# EAGLE design Wireless Module ESP32-H2 V1.0 (EAGLE 9.6.2)
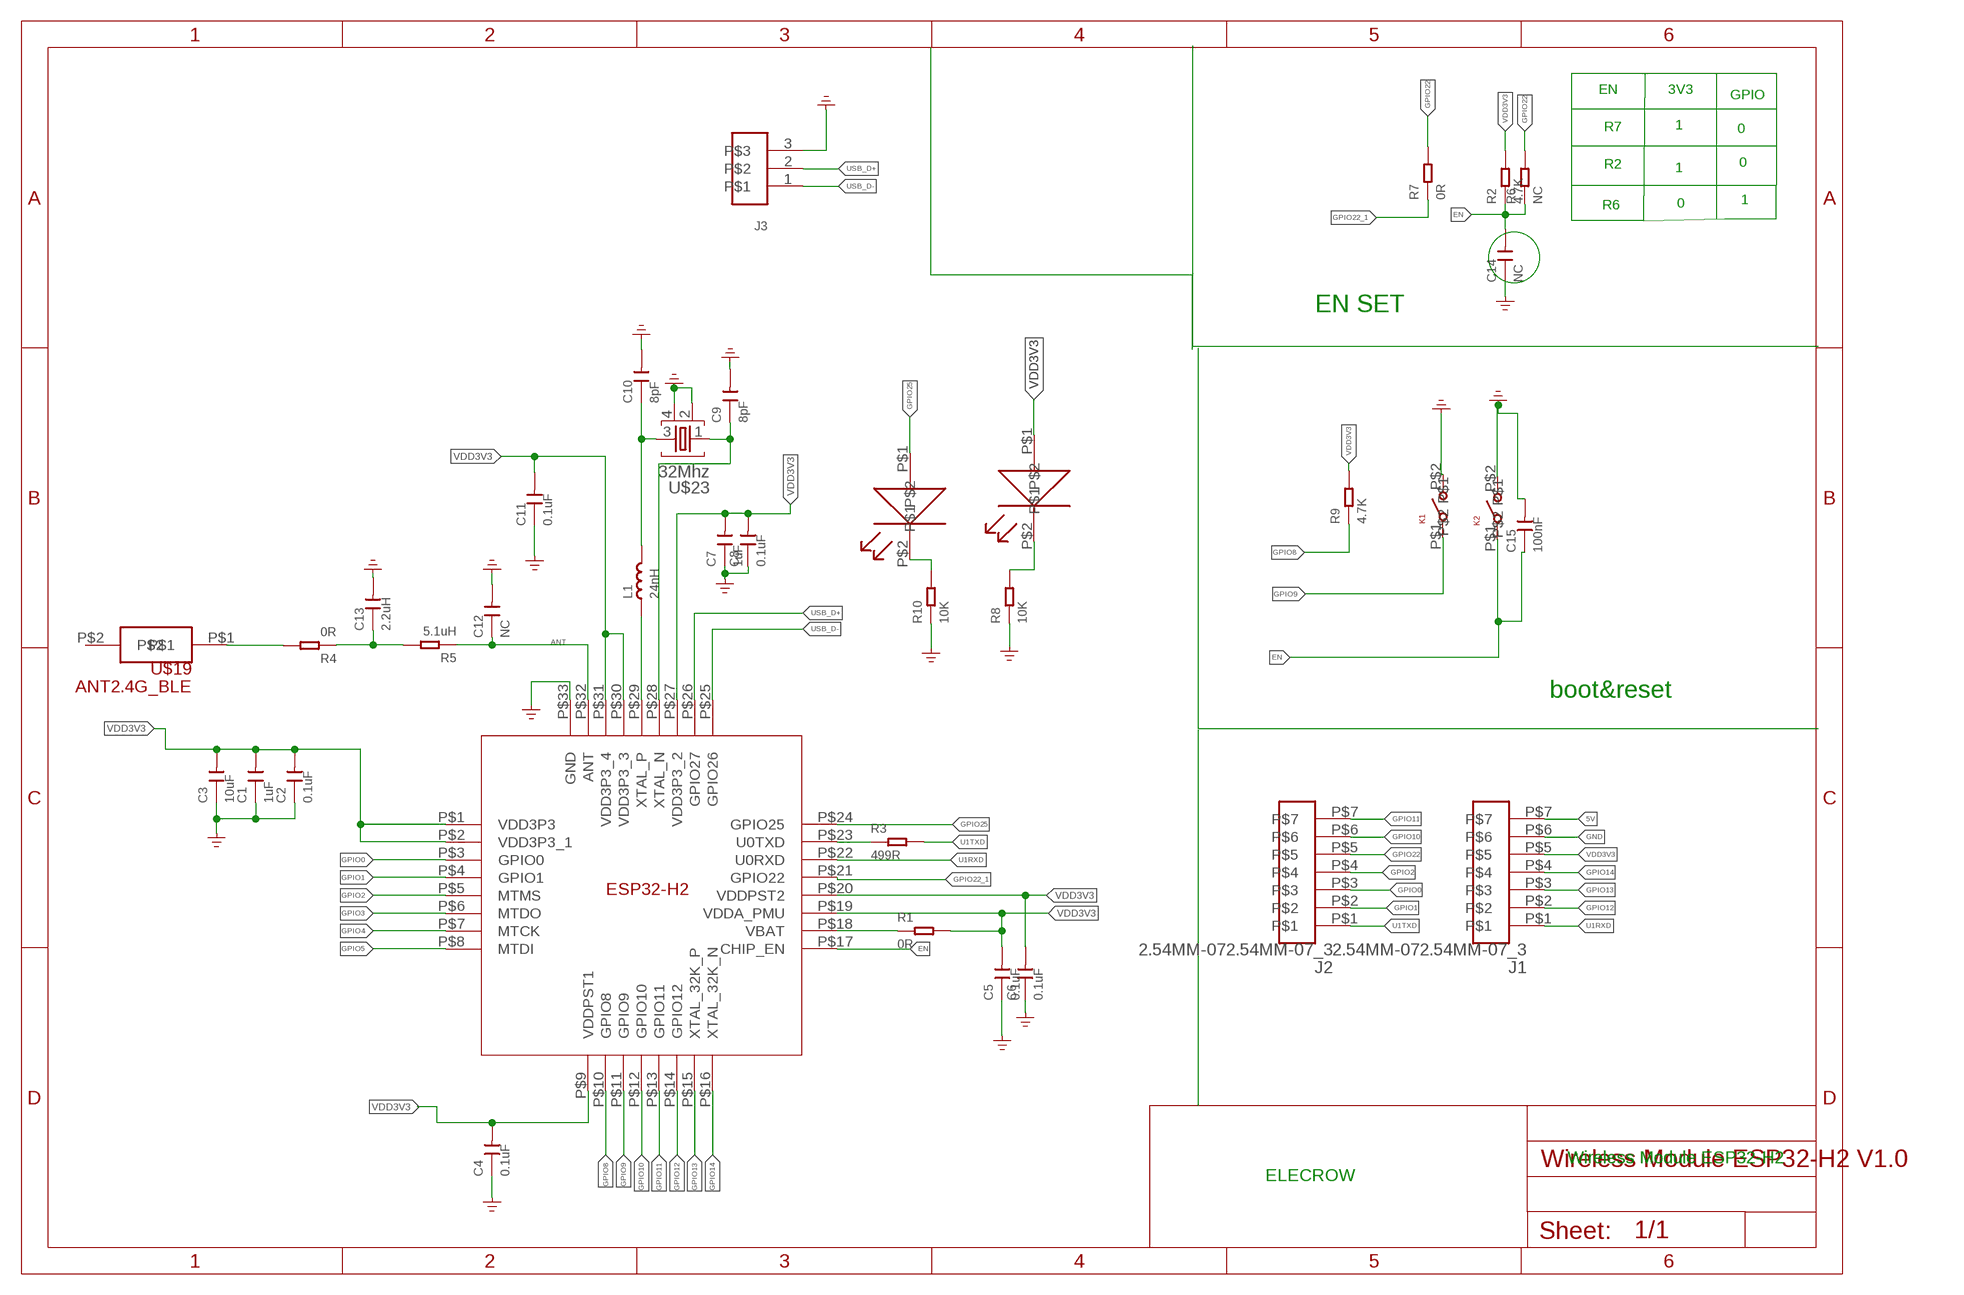
[diagram p0: schematic, sheet 1]

## Parts
C1  1uF  DISCRETE-NEW_CAP-0402  [DISCRETE-NEW_C0402]
C2  0.1uF  DISCRETE-NEW_CAP-0402  [DISCRETE-NEW_C0402]
C3  10uF  DISCRETE-NEW_CAP-0402  [DISCRETE-NEW_C0402]
C4  0.1uF  DISCRETE-NEW_CAP-0402  [DISCRETE-NEW_C0402]
C5  0.1uF  DISCRETE-NEW_CAP-0402  [DISCRETE-NEW_C0402]
C6  0.1uF  DISCRETE-NEW_CAP-0402  [DISCRETE-NEW_C0402]
C7  1uF  DISCRETE-NEW_CAP-0402  [DISCRETE-NEW_C0402]
C8  0.1uF  DISCRETE-NEW_CAP-0402  [DISCRETE-NEW_C0402]
C9  8pF  DISCRETE-NEW_CAP-0402  [DISCRETE-NEW_C0402]
C10  8pF  DISCRETE-NEW_CAP-0402  [DISCRETE-NEW_C0402]
C11  0.1uF  DISCRETE-NEW_CAP-0402  [DISCRETE-NEW_C0402]
C12  NC  DISCRETE-NEW_CAP-0402  [DISCRETE-NEW_C0402]
C13  2.2uH  DISCRETE-NEW_CAP-0402  [DISCRETE-NEW_C0402]
C14  NC  DISCRETE-NEW_CAP-0402  [DISCRETE-NEW_C0402]
C15  100nF  DISCRETE-NEW_CAP-0402  [DISCRETE-NEW_C0402]
J1  2.54MM-072.54MM-07_3  [2.54MM-07_3]
J2  2.54MM-072.54MM-07_3  [2.54MM-07_3]
J3  1.27MM-3P  [1.27MM-3P]
K1  KEY_SMD  [KEY_3*2.5]
K2  KEY_SMD  [KEY_3*2.5]
L1  24nH  DISCRETE-NEW_INDUCTOR/FERRITE-BEAD0402  [DISCRETE-NEW_L0402]
LED1  LED_SMT  [LED_0402]
LED2  LED_SMT  [LED_0402]
R1  0R  DISCRETE-NEW_RES-0402  [DISCRETE-NEW_R0402]
R2  4.7K  DISCRETE-NEW_RES-0402  [DISCRETE-NEW_R0402]
R3  499R  DISCRETE-NEW_RES-0402  [DISCRETE-NEW_R0402]
R4  0R  DISCRETE-NEW_RES-0402  [DISCRETE-NEW_R0402]
R5  5.1uH  DISCRETE-NEW_RES-0402  [DISCRETE-NEW_R0402]
R6  NC  DISCRETE-NEW_RES-0402  [DISCRETE-NEW_R0402]
R7  0R  DISCRETE-NEW_RES-0402  [DISCRETE-NEW_R0402]
R8  10K  DISCRETE-NEW_RES-0402  [DISCRETE-NEW_R0402]
R9  4.7K  DISCRETE-NEW_RES-0402  [DISCRETE-NEW_R0402]
R10  10K  DISCRETE-NEW_RES-0402  [DISCRETE-NEW_R0402]
U$1  ESP32-H2  [ESP32-H2]
U$19  ANT2.4G_BLE  [2.4G_BLE]
U$23  32Mhz  NORDIC_NRF_XTAL_32MHZ  [NORDIC_NRF_BT-XTAL_2016_N]

## Nets
5V: J1.P$7
ANT: C12.1 R5.1 U$1.P$32(ANT)
EN: C14.2 C15.1 K2.P$1 R2.1 R6.1 U$1.P$17(CHIP_EN)
GND: C1.1 C2.1 C3.1 C4.1 C5.1 C6.1 C7.1 C8.1 C9.2 C10.2 C11.1 C12.2 C13.2 C14.1 C15.2 J1.P$6 J3.3 K1.P$2 K2.P$2 R8.1 R10.1 U$1.P$33(GND) U$23.2 U$23.4 ; supply symbol labelled POWER-OR-GND-_GND_POWER
GPIO0: J2.P$3 U$1.P$3(GPIO0)
GPIO1: J2.P$2 U$1.P$4(GPIO1)
GPIO2: J2.P$4 U$1.P$5(MTMS)
GPIO3: U$1.P$6(MTDO)
GPIO4: U$1.P$7(MTCK)
GPIO5: U$1.P$8(MTDI)
GPIO8: R9.1 U$1.P$10(GPIO8)
GPIO9: K1.P$1 U$1.P$11(GPIO9)
GPIO10: J2.P$6 U$1.P$12(GPIO10)
GPIO11: J2.P$7 U$1.P$13(GPIO11)
GPIO12: J1.P$2 U$1.P$14(GPIO12)
GPIO13: J1.P$3 U$1.P$15(XTAL_32K_P)
GPIO14: J1.P$4 U$1.P$16(XTAL_32K_N)
GPIO22: J2.P$5 R6.2 R7.2
GPIO22_1: R7.1 U$1.P$21(GPIO22)
GPIO25: LED1.P$1 U$1.P$24(GPIO25)
N$1: C13.1 R4.1 R5.2
N$3: R3.1 U$1.P$23(U0TXD)
N$5: C10.1 L1.2 U$23.3
N$6: C9.1 U$1.P$28(XTAL_N) U$23.1
N$10: LED2.P$2 R8.2
N$11: LED1.P$2 R10.2
N$12: R4.2 U$19.P$1
N$13: L1.1 U$1.P$29(XTAL_P)
P$18: R1.1 U$1.P$18(VBAT)
U1RXD: J1.P$1 U$1.P$22(U0RXD)
U1TXD: J2.P$1 R3.2
USB_D+: J3.2 U$1.P$26(GPIO27)
USB_D-: J3.1 U$1.P$25(GPIO26)
VDD3V3: C1.2 C2.2 C3.2 C4.2 C5.2 C6.2 C7.2 C8.2 C11.2 J1.P$5 LED2.P$1 R1.2 R2.2 R9.2 U$1.P$1(VDD3P3) U$1.P$2(VDD3P3_1) U$1.P$9(VDDPST1) U$1.P$19(VDDA_PMU) U$1.P$20(VDDPST2) U$1.P$27(VDD3P3_2) U$1.P$30(VDD3P3_3) U$1.P$31(VDD3P3_4)
Unconnected: U$19.P$2

## Notes on the sheet
- EN | 3V3
- GPIO
- R7 | 1 | 0
- R2 | 0
- 1
- 0 | 1
- R6
- EN SET
- boot&reset
- Wireless Module ESP32-H2
- ELECROW

## Library data of the parts
C1-C15 = Xadow-GPS-v2:DISCRETE-NEW_CAP: Ceramic Capacitors
J1 J2 = myself:2.54MM-07
J3 = myself:1.27MM-3P
K1 K2 = myself:KEY_SMD
L1 = Xadow-GPS-v2:DISCRETE-NEW_INDUCTOR/FERRITE-BEAD
LED1 LED2 = myself:LED_SMT
R1-R10 = Xadow-GPS-v2:DISCRETE-NEW_RES
U$1 = ESP32-H2:ESP32-H2
U$19 = ESP32-H2:ANT
U$23 = nRF52832_MCU:NORDIC_NRF_XTAL_32MHZ

## Net classes
0 default: clearance 0.127 mm

## Board
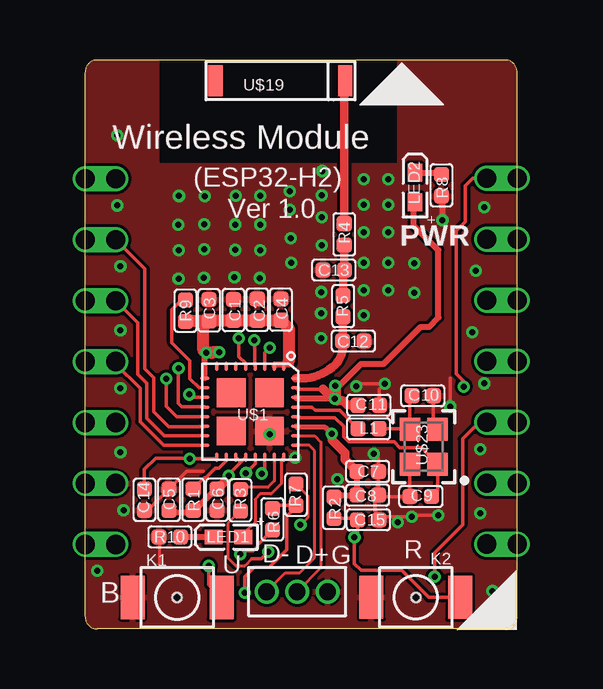
[diagram p1: board, top side]
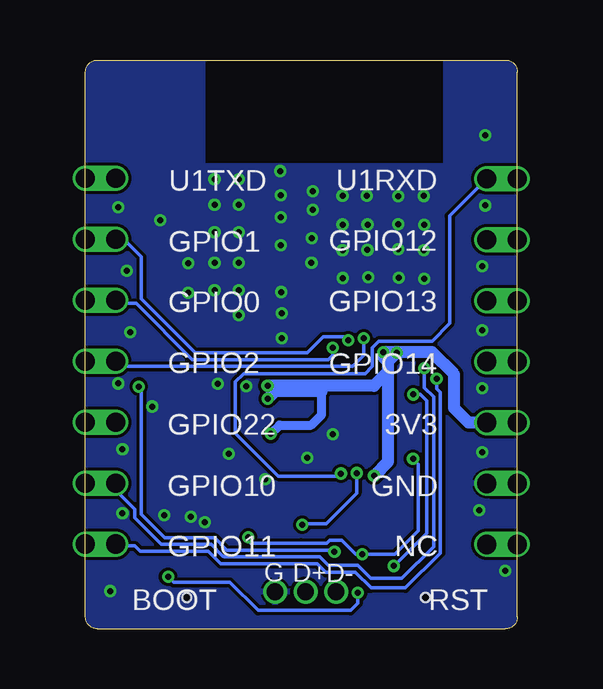
[diagram p2: board, bottom side, seen from below]

Size 18 x 23.7 mm. Coordinates in mm from the lower left corner, seen from the top.
Outline: 17.5,0 0.5,0 arc-90 0,0.5 0,23.2 arc-90 0.5,23.7 17.5,23.7 arc-90 18,23.2 18,0.5 arc-90 17.5,0
Copper layers (1*16): Top 0.035mm / dielectric 1.5mm / Bottom 0.035mm
Design rules "default *": minimum track width 5mil, minimum drill 0.25mm, track to track 4mil, track to pad 4mil, pad to pad 4mil, via to via 4mil, smd to smd 4mil, copper to edge 1mil, drill to drill 4mil, minimum pad ring 5mil, minimum via ring 5mil, stop-mask expansion 4mil, vias tented up to drill 32mil, thermal gap 4mil
tRestrict: area 3.1,19.4 to 13,23.7
bRestrict: area 3.1,19.4 to 13,23.7

### Footprints (pad centres in the part's own frame; a part is rotated, then mirrored left to right if it is on the bottom)
DISCRETE-NEW_C0402 = smd 0.635 x 0.635: 1 0,0.445; 2 0,-0.445
2.54MM-07_3 = drill 0.8 pad 1 offset: P$1 0,0; P$2 2.54,0; P$3 5.08,0; P$4 7.62,0; P$5 10.16,0; P$6 12.7,0; P$7 15.24,0; P$8 0,-1.27; P$9 2.54,-1.27; P$10 5.08,-1.27; P$11 7.62,-1.27; P$12 10.16,-1.27; P$13 12.7,-1.27; P$14 15.24,-1.27
1.27MM-3P = drill 0.7 pad 1: 1 -1.27,0; 2 0,0; 3 1.27,0
KEY_3*2.5 = smd 1 x 1.8: P$1 -1.85,0; P$2 1.85,0 | hole 0.375: 0,0
DISCRETE-NEW_L0402 = smd 0.635 x 0.635: 1 -0.445,0; 2 0.445,0
LED_0402 = smd 0.75 x 0.6: P$1 0,0; P$2 -1.233,0
DISCRETE-NEW_R0402 = smd 0.635 x 0.635: 1 0,0.445; 2 0,-0.445
ESP32-H2 = smd 0.4 x 0.15: P$1 0.1,-0.6; P$2 0.1,-1; P$3 0.1,-1.4; P$4 0.1,-1.8; P$5 0.1,-2.2; P$6 0.1,-2.6; P$7 0.1,-3; P$8 0.1,-3.4; P$17 3.9,-3.4; P$18 3.9,-3; P$19 3.9,-2.6; P$20 3.9,-2.2; P$21 3.9,-1.8; P$22 3.9,-1.4; P$23 3.9,-1; P$24 3.9,-0.6 | smd 0.15 x 0.4: P$9 0.6,-3.9; P$10 1,-3.9; P$11 1.4,-3.9; P$12 1.8,-3.9; P$13 2.2,-3.9; P$14 2.6,-3.9; P$15 3,-3.9; P$16 3.4,-3.9; P$25 3.4,-0.1; P$26 3,-0.1; P$27 2.6,-0.1; P$28 2.2,-0.1; P$29 1.8,-0.1; P$30 1.4,-0.1; P$31 1,-0.1; P$32 0.6,-0.1 | smd 1.2 x 1.2: P$33 2.8,-1.2; P$34 1.2,-1.2; P$35 1.2,-2.8; P$36 2.8,-2.8
2.4G_BLE = smd 0.6 x 1.3: P$1 0,0; P$2 5.4,0
NORDIC_NRF_BT-XTAL_2016_N = smd 0.95 x 0.85: 1 -0.725,-0.575; 2 0.725,-0.575; 3 0.725,0.575; 4 -0.725,0.575

### Placement (x,y rotation side)
C1  6.18,13.29 0 top
C2  7.17,13.3 0 top
C3  5.16,13.27 0 top
C4  8.15,13.3 0 top
C5  3.49,5.38 0 top
C6  5.49,5.38 180 top
C7  11.77,6.56 270 top
C8  11.77,5.57 270 top
C9  13.98,5.51 270 top
C10  14.07,9.71 90 top
C11  11.82,9.32 270 top
C12  11.17,11.99 90 top
C13  10.36,14.96 270 top
C14  2.47,5.38 180 top
C15  11.8,4.54 90 top
J1  1.28,18.76 270 top
J2  18.01,18.77 270 top
J3  8.83,1.55 0 top
K1  3.83,1.31 180 top
K2  13.78,1.31 180 top
L1  11.81,8.34 0 top
LED1  6.58,3.82 0 top
LED2  13.74,17.77 270 top
R1  4.5,5.38 0 top
R2  10.36,5.05 180 top
R3  6.47,5.36 0 top
R4  10.79,16.44 180 top
R5  10.75,13.45 180 top
R6  7.8,4.57 180 top
R7  8.79,5.59 0 top
R8  14.84,18.48 180 top
R9  4.18,13.26 0 top
R10  3.53,3.83 90 top
U$1  8.88,11.05 270 top
U$19  10.84,22.84 180 top
U$23  14.11,7.59 90 top

### Tracks (layer width: path | path; a pad name or v marks a point on that pad's centre or on a via)
ANT
  Top 0.357: R5.1 10.73,12.98 C12.1 10.73,11.76 arc-45 10.42,11.01 arc-45 9.05,10.45 U$1.P$32
EN  (via drill 0.25)
  Top 0.152: v6.46,3.11 6.61,3.26 7,3.26 7.18,3.45 7.18,3.51 R6.1 | C14.2 2.47,6.65 2.93,7.11 4.33,7.11 v4.35,7.09 4.37,7.1 5.44,7.1 U$1.P$17 | K2.P$1 14.31,1.31 13.18,2.44 11.5,2.44 11.22,2.72 v11.22,3.81 11.35,3.94 11.35,4.51 | C15.1 11.35,4.51 | R2.1 11.26,4.6 11.35,4.51
  Bottom 0.152: v4.35,7.09 4.14,6.87 4.14,4.09 5.11,3.11 v6.46,3.11 6.74,3.11 7.33,3.69 7.83,3.69 7.95,3.57 9.02,3.57 11.1,3.57 11.22,3.69 v11.22,3.81
GND  (via drill 0.25)
  Top 0.127: R10.1 3.08,2.71
  Top 0.152: 12.07,5.6 12.15,5.51 13.52,5.51 | 13.52,5.51 C9.2 | U$23.2 14.51,8.48 C10.2 | C11.1 12.26,9.99 v12.48,10.21 11.4,10.21 v11.3,10.11 | 15.2,10.45 15.21,10.44 v15.21,9.27 | 14.71,4.8 v14.71,4.74 13.67,4.74 v13.61,4.68 12.31,4.68 12.07,4.92 12.07,5.6 | 12.07,5.6 12.07,5.72 C8.1 C7.1 12.22,7.1 v12.02,7.3 | C14.1 2.6,4.94 C5.1 4.24,6.57 4.91,6.57 | U$23.4 13.53,5.53 13.52,5.51
  Top 0.254: R8.1 14.89,17.99 v14.89,17.03
  other vias: 9.87,17.15 11.61,17.67 9.87,15.98 11.61,16.53 8.58,15.26 11.61,15.26 9.84,14.04 11.61,14.11 12.62,17.67 12.62,16.53 12.62,15.26 12.62,14.11 6.27,18.05 7.29,18.05 6.25,16.85 7.29,16.85 8.53,17.47 8.57,16.27 1.34,17.64 1.47,15.1 1.47,12.44 1.47,10.02 1.47,7.36 13.71,15.23 13.71,14.01 11.61,13.07 1.34,20.56 1.6,4.94 0.51,2.43 16.97,1.58 16.46,4.82 16.46,7.48 16.63,10.23 3.89,14.59 4.95,14.63 6.22,14.65 7.29,15.78 7.69,8.12 8.76,7.14 3.91,18.04 4.97,18.03 3.88,16.85 4.96,16.87 3.9,15.79 4.97,15.82 6.25,15.79 7.27,14.62 16.13,12.36 13.03,4.44 16.28,14.93 16.63,17.57 10.51,6.24 9.83,13.15 9.83,12.11 11.61,18.74 12.62,18.74 9.88,19.08 9.87,18.08 8.53,18.23
  pour Top: -1.27,23.97 19.38,23.97 19.38,-0.24 -1.27,-0.24
  pour Bottom: -1.18,23.9 19.09,23.9 19.09,-0.14 -1.18,-0.14
  cutout Top: 13,8.9 15.26,8.9 15.26,6.23 13,6.23
GPIO0  (via drill 0.25)
  Top 0.152: v7.69,11.71 7.49,11.51 U$1.P$3
  Bottom 0.152: v7.69,11.71 7.69,11.41 7.89,11.22 13.54,11.22 15.89,13.57 17.88,13.57 J2.P$3
GPIO1  (via drill 0.25)
  Top 0.152: U$1.P$4 7.07,12 v7.05,12.03
  Bottom 0.152: v7.05,12.03 7.19,12.17 8.1,12.17 8.76,11.51 13.43,11.51 15.67,13.75 15.67,15.5 16.4,16.23 J2.P$2
GPIO2  (via drill 0.25)
  Top 0.152: U$1.P$5 6.69,11.06 6.4,11.35 v6.4,12.1
  Bottom 0.152: v6.4,12.1 6.4,11.39 6.86,10.94 17.79,10.94 J2.P$4
GPIO8
  Top 0.152: U$1.P$10 4.75,10.05 4.36,10.43 4.36,11.17 3.61,11.92 3.61,13.3 4.01,13.7 R9.1
GPIO9  (via drill 0.25)
  Top 0.152: U$1.P$11 4.46,9.65 v4.34,9.77 | v5.15,2.62 5.15,1.84 K1.P$1
  Bottom 0.152: v4.34,9.77 4.04,9.77 3.77,9.5 3.77,3.98 5.13,2.62 v5.15,2.62
GPIO10  (via drill 0.25)
  Top 0.152: U$1.P$12 4.03,9.25 3.88,9.39 v3.88,10.85 v3.89,10.86
  Bottom 0.152: v3.89,10.86 v3.88,10.85 3.88,10.05 3.5,9.66 3.5,3.43 4.81,2.11 6.11,2.11 6.64,2.65 7.88,2.65 8.24,3 12.22,3 12.25,3.03 12.27,3.03 12.76,3.52 14.85,3.52 15.95,4.62 15.95,4.99 17.04,6.07 J2.P$6
GPIO11  (via drill 0.25)
  Top 0.152: U$1.P$13 4.98,8.84 3.81,8.84 3.37,9.28 v3.37,10.43
  Bottom 0.152: v3.37,10.43 3.37,10.01 3.22,9.86 3.22,3.16 4.67,1.71 6.1,1.71 6.75,2.36 7.98,2.36 8.35,2.72 12.37,2.72 12.88,3.24 15.73,3.24 15.94,3.46 17.93,3.46 J2.P$7
GPIO12
  Top 0.152: U$1.P$14 4.97,8.43 3.49,8.43 2.86,9.05 2.86,10.47 2.49,10.85 2.49,15 J1.P$2
GPIO13
  Top 0.152: U$1.P$15 3.3,8.05 2.57,8.78 2.57,10.24 2.2,10.61 2.2,12.76 J1.P$3
GPIO14
  Top 0.152: U$1.P$16 3.28,7.65 2.29,8.63 2.29,10.02 1.28,11.04 J1.P$4
GPIO22  (via drill 0.25)
  Top 0.152: v14.56,2.17 14.56,3.16 15.73,4.33 15.73,7.91 16.43,8.61 J2.P$5 | R6.2 7.8,5.11 7.83,5.15 R7.2 8.79,5.1 8.39,4.7 8.39,3.3 7.66,2.57 7.05,2.57 6.65,2.17 v6.65,1.5
  Bottom 0.152: v14.56,2.17 14.33,1.94 11.98,1.94 10.81,0.77 6.95,0.77 6.65,1.07 v6.65,1.5
GPIO22_1  (via drill 0.25)
  Top 0.127: R7.1 9.29,5.53 9.29,4.66 v8.97,4.33
  Top 0.152: v6.7,6.5 7.08,6.88 U$1.P$21
  Bottom 0.152: v6.7,6.5 6.7,5.65 7.98,4.37 8.93,4.37 v8.97,4.33
GPIO25
  Top 0.127: U$1.P$24 8.17,7.03 8.17,6.05 7.74,5.62 7.3,5.62 7.08,5.4 7.08,4.45 6.58,3.96 LED1.P$1
N$1
  Top 0.357: R5.2 10.75,14.9 C13.1 10.79,14.97 R4.1
N$3
  Top 0.127: R3.1 6.57,5.9 7.61,5.9 7.88,6.17 U$1.P$23
N$5
  Top 0.152: L1.2 13.51,8.34 U$23.3 13.53,9.62 C10.1
N$6
  Top 0.152: U$1.P$28 8.83,8.8 10.4,8.8 10.76,8.44 10.76,8 10.98,7.79 12.87,7.79 13.12,7.54 14.04,7.54 14.16,7.42 14.16,7.38 U$23.1 14.68,5.77 C9.1
N$10
  Top 0.152: 14.77,19 R8.2
  Top 0.254: LED2.P$2 14.77,19
N$11
  Top 0.254: LED1.P$2 R10.2
N$12
  Top 0.357: U$19.P$1 10.79,22.8 R4.2
N$13
  Top 0.152: U$1.P$29 9.44,9.25 9.59,9.1 10.6,9.1 L1.1
P$18
  Top 0.152: R1.1 4.96,6.29 5.03,6.29 5.42,6.69 5.57,6.69 5.88,7 U$1.P$18
U1RXD  (via drill 0.25)
  Top 0.152: U$1.P$22 7.48,6.61 v7.35,6.48
  Bottom 0.152: J1.P$1 2.82,17.21 2.82,12.73 3.56,11.99 5.78,11.99 6.05,11.72 6.05,10.94 6.35,10.64 11.41,10.64 11.75,10.3 11.75,8.14 9.97,6.36 7.47,6.36 v7.35,6.48
U1TXD  (via drill 0.25)
  Top 0.127: R3.2 5.95,4.39 5.95,2.97 6.28,2.64 6.67,2.64 6.95,2.92
  Top 0.152: v15.78,10.1 15.78,10.31 15.46,10.63 15.46,16.58 15.84,16.97 15.84,18.47 16.15,18.77 J2.P$1 | v7.62,3.21 7.33,2.92 6.95,2.92
  Bottom 0.152: v15.78,10.1 15.67,9.99 15.67,4.78 14.7,3.8 12.62,3.8 12.11,3.28 7.69,3.28 v7.62,3.21
USB_D+
  Top 0.127: U$1.P$26 9.56,8.05 9.82,7.79 9.82,2.54 J3.2
USB_D-
  Top 0.127: J3.1 8.35,2.34 8.93,2.34 9.57,2.97 9.57,7.42 9.34,7.65 U$1.P$25
VDD3V3  (via drill 0.25)
  Top 0.152: R1.2 4.41,4.85 | C5.2 3.58,4.85 | U$1.P$19 6.45,6.98 6.45,6.91 | U$1.P$20 6.45,6.91 | 6.45,6.91 5.98,6.44 | 9.91,10 8.83,10 U$1.P$31 | 13.7,17.72 LED2.P$1
  Top 0.203: U$1.P$27 8.83,8.4 10.01,8.4 v10.28,8.12 | 10.31,9.6 v10.4,9.6 10.5,9.5
  Top 0.254: C6.2 5.45,5.83 4.47,4.85 4.41,4.85 3.58,4.85 | 8.48,11.14 U$1.P$1 8.23,11 7.93,11 U$1.P$2 | U$1.P$9 4.98,11.45 v5.04,11.5 | C7.2 C8.2 11.3,5.55 10.42,5.55 R2.2 | U$1.P$30 8.83,9.6 10.31,9.6 | v10.41,10.14 10.6,10.14 11.49,11.03 12.42,11.03 13.98,12.59 14.33,12.59 14.72,12.98 14.72,15.78 13.7,16.8 13.7,17.72
  Top 0.381: v10.28,8.12 10.28,7.89 10.83,7.34 10.83,7.06 C7.2 | C11.2 10.94,9.32 10.76,9.5 10.5,9.5 v10.4,9.59 | C6.2 6.02,6.35 v5.98,6.39 5.98,6.44 | 9.91,10 10.31,9.6
  Top 0.508: v10.41,10.14 v10.41,10.13 v10.4,10.12 v10.4,9.59 | R9.2 4.2,12.83 C3.2 4.93,12.6 | C1.2 5.94,12.84 5.93,12.85 | 5.93,12.85 C2.2 C4.2 8.48,12.53 8.48,11.14 | 5.93,12.85 4.93,12.85 4.93,12.6 | v5.59,11.54 v5.58,11.53 5.3,11.53 5.27,11.5 v5.04,11.5 4.93,11.61 4.93,12.6
  Bottom 0.381: v10.28,8.12 9.91,8.49 8.6,8.49 8.16,8.93 8.16,9.9
  Bottom 0.508: 8.16,9.9 10.09,9.9 v10.4,9.59 | v5.04,11.5 5.4,11.14 | 5.4,11.14 5.4,10.71 | 5.4,10.71 5.98,10.13 v10.41,10.13 | 5.4,11.14 5.59,11.33 v5.59,11.54 3.57,11.54 2.64,10.6 2.64,9.2 2.04,8.6 J1.P$5 | 5.4,10.71 5.4,6.97 v5.98,6.39

### Text on the board
tPlace: Wireless Module | (ESP32-H2) | Ver 1.0 | PWR | U | D- | D+ | G | R | B
bPlace: U1RXD | U1TXD | GPIO12 | GPIO1 | GPIO13 | GPIO0 | GPIO14 | GPIO2 | 3V3 | GPIO22 | GND | GPIO10 | NC | GPIO11 | D- | D+ | G | RST | BOOT
tNames: U$19 | LED2 | U$1 | LED1 | K1 | K2
tValues: OA-C09 | GREEN | ESP32-H2 | RED | TD-1183SN | TD-1183SN